# Altium schematic sheet BikerBlinker.SchDoc
size A
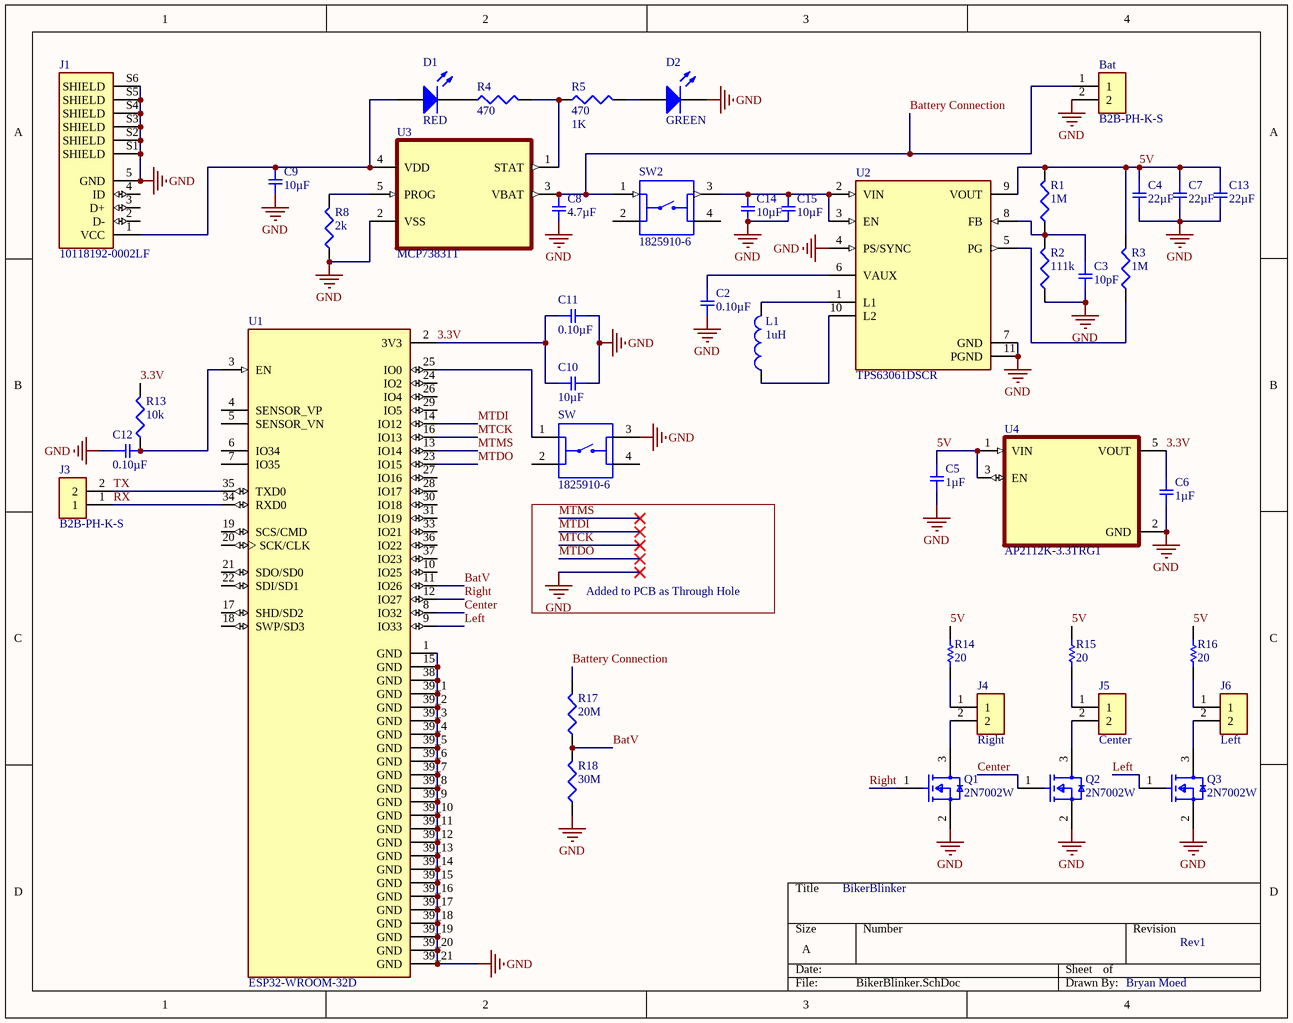
[diagram p0: BikerBlinker.SchDoc]

## Parts
Bat  B2B-PH-K-S  [JST_B2B-PH-K-S(LF)(SN)]
C2  0.10µF  [SMD-0603C]
C3  10pF  [SMD-0603C]
C4  22µF  [SMD-0603C]
C5  1µF  [SMD-0603C]
C6  1µF  [SMD-0603C]
C7  22µF  [SMD-0603C]
C8  4.7µF  [SMD-0603C]
C9  10µF  [SMD-0603C]
C10  10µF  [SMD-0603C]
C11  0.10µF  [SMD-0603C]
C12  0.10µF  [SMD-0603C]
C13  22µF  [SMD-0603C]
C14  10µF  [SMD-0603C]
C15  10µF  [SMD-0603C]
D1  RED  [J1-0603]
D2  GREEN  [J1-0603]
J1  10118192-0002LF  [AMPHENOL_10118192-0002LF]
J3  B2B-PH-K-S  [JST_B2B-PH-K-S(LF)(SN)]
J4  Right  [JST_B2B-PH-K-S(LF)(SN)]
J5  Center  [JST_B2B-PH-K-S(LF)(SN)]
J6  Left  [JST_B2B-PH-K-S(LF)(SN)]
L1  1uH  [0603]
Q1  2N7002W  [FP-419AB-01-IPC_C]
Q2  2N7002W  [FP-419AB-01-IPC_C]
Q3  2N7002W  [FP-419AB-01-IPC_C]
R1  1M  [J1-0603]
R2  111k  [J1-0603]
R3  1M  [J1-0603]
R4  470  [J1-0603]
R5  470  value 1K  [J1-0603]
R8  2k  [J1-0603]
R13  10k  [J1-0603]
R14  20  [AXIAL-0.3]
R15  20  [AXIAL-0.3]
R16  20  [AXIAL-0.3]
R17  20M  [J1-0603]
R18  30M  [J1-0603]
SW  1825910-6  [SW_1825910-6-4]
SW2  1825910-6  [SW_1825910-6-4]
U1  ESP32-WROOM-32D  [MODULE_ESP32-WROOM-32D]
U2  TPS63061DSCR  [CONV_TPS63061DSCR]
U3  MCP73831T  [SOT95P280X145-5N]
U4  AP2112K-3.3TRG1  [SOT95P285X140-5N]

## Nets
GND: Bat.2 C2.2 C3.2 C4.2 C5.2 C6.2 C7.2 C8.2 C9.2 C10.2 C11.2 C12.1 C13.2 C14.2 C15.2 D2.2(K) J1.5(GND) J1.S1(SHIELD) J1.S2(SHIELD) J1.S3(SHIELD) J1.S4(SHIELD) J1.S5(SHIELD) J1.S6(SHIELD) Q1.2(Source) Q2.2(Source) Q3.2(Source) R2.1 R8.1 R18.1 SW.3 U1.1(GND) U1.15(GND) U1.38(GND) U1.39_1(GND) U1.39_2(GND) U1.39_3(GND) U1.39_4(GND) U1.39_5(GND) U1.39_6(GND) U1.39_7(GND) U1.39_8(GND) U1.39_9(GND) U1.39_10(GND) U1.39_11(GND) U1.39_12(GND) U1.39_13(GND) U1.39_14(GND) U1.39_15(GND) U1.39_16(GND) U1.39_17(GND) U1.39_18(GND) U1.39_19(GND) U1.39_20(GND) U1.39_21(GND) U2.4(PS/SYNC) U2.7(GND) U2.11(PGND) U3.2(VSS) U4.2(GND)
3.3V: C6.1 C10.1 C11.1 R13.2 U1.2(3V3) U4.5(VOUT)
5V: C4.1 C5.1 C7.1 C13.1 R1.2 R3.2 R14.2 R15.2 R16.2 U2.9(VOUT) U4.1(VIN) U4.3(EN)
Battery Connection: Bat.1 C8.1 R17.2 SW2.1 U3.3(VBAT)
BatV: R17.1 R18.2 U1.11(IO26)
Center: Q2.1(Gate) U1.8(IO32)
Left: Q3.1(Gate) U1.9(IO33)
MTCK: U1.16(IO13)
MTDI: U1.14(IO12)
MTDO: U1.23(IO15)
MTMS: U1.13(IO14)
Right: Q1.1(Gate) U1.12(IO27)
RX: J3.1 U1.34(RXD0)
TX: J3.2 U1.35(TXD0)
NetC2_1: C2.1 U2.6(VAUX)
NetC3_1: C3.1 R1.1 R2.2 U2.8(FB)
NetC9_1: C9.1 D1.1(A) J1.1(VCC) U3.4(VDD)
NetC12_2: C12.2 R13.1 U1.3(EN)
NetC14_1: C14.1 C15.1 SW2.3 U2.2(VIN) U2.3(EN)
NetD1_2: D1.2(K) R4.1
NetD2_1: D2.1(A) R5.2
NetJ4_1: J4.1 R14.1
NetJ4_2: J4.2 Q1.3(Drain)
NetJ5_1: J5.1 R15.1
NetJ5_2: J5.2 Q2.3(Drain)
NetJ6_1: J6.1 R16.1
NetJ6_2: J6.2 Q3.3(Drain)
NetL1_1: L1.1 U2.10(L2)
NetL1_2: L1.2 U2.1(L1)
NetR3_1: R3.1 U2.5(PG)
NetR4_2: R4.2 R5.1 U3.1(STAT)
NetR8_2: R8.2 U3.5(PROG)
NetSW_1: SW.1 U1.25(IO0)

Not connected (* = marked no-connect by the designer): J1 2(D-) 3(D+) 4(ID); SW 2 4; SW2 2 4; U1 4(SENSOR_VP) 5(SENSOR_VN) 6(IO34) 7(IO35) 10(IO25) 17(SHD/SD2) 18(SWP/SD3) 19(SCS/CMD) 20(SCK/CLK) 21(SDO/SD0) 22(SDI/SD1) 24(IO2) 26(IO4) 27(IO16) 28(IO17) 29(IO5) 30(IO18) 31(IO19) 33(IO21) 36(IO22) 37(IO23); U4 4(NC)

## Notes on the sheet
- Added to PCB as Through Hole
- BikerBlinker
- Rev1
- Bryan Moed

## Library data of the parts
Bat J3-J6 = B2B-PH-K-S(LF)(SN): Connector Header Through Hole 2 position 0.079 _2.00mm_; MF: JST Sales; MP: B2B-PH-K-S_LF__SN_; Package: None; Value: *; Price: None; Availability: Unavailable; SnapEDA_Link: https://www.snapeda.com/parts/B2B-PH-K-S%28LF%29%28SN%29/JST%20Sales%20America%20Inc./view-part/424103/?ref=snap
C2 C11 C12 = GCJ188R71C104KA01D: CAP CER 0.1UF 16V X7R 0603; Manufacturer: Murata Electronics North America; Factory Stock: 0; Unit Price (USD): 0.21; Minimum Quantity: 1; Tolerance: ±10%; Datasheets: http://www.murata.com/~/media/webrenewal/support/library/catalog/products/capacitor/mlcc/c03e.ashx; Image: //media.digikey.com/Renders/Murata%20Renders/0603%28LQG18%29.jpg; Digi-Key Part Number: 490-5796-1-ND; Part Number: GCJ188R71C104KA01D; Quantity Available: 22473; @ qty: 0; Packaging: Cut Tape (CT); Series: GCJ; Part Status: Active; Value: 0.10µF; Voltage: 16V; Temperature Coefficient: X7R; Operating Temperature: -55°C ~ 125°C; Features: Soft Termination; Ratings: AEC-Q200; Applications: Automotive, Boardflex Sensitive; Mounting Type: Surface Mount, MLCC; Package / Case: 0603 (1608 Metric); Size / Dimension: 0.063" L x 0.031" W (1.60mm x 0.80mm); Height - Seated (Max): -; Thickness (Max): 0.035" (0.90mm); Lead Spacing: -; Lead Style: -
C3 = GCM1885C1H100FA16D: CAP CER 10PF 50V NP0 0603; Manufacturer: Murata Electronics North America; Factory Stock: 0; Unit Price (USD): 0.11; Minimum Quantity: 1; Tolerance: ±1%; Temperature Coefficient: C0G, NP0; Datasheets: http://psearch.en.murata.com/capacitor/product/GCM1885C1H100FA16%23.pdf; Image: //media.digikey.com/Renders/Murata%20Renders/0603%28GCM188%29.jpg; Digi-Key Part Number: 490-12530-1-ND; Part Number: GCM1885C1H100FA16D; Quantity Available: 652; @ qty: 0; Packaging: Cut Tape (CT); Series: GCM; Part Status: Active; Value: 10pF; Voltage: 50V; Operating Temperature: -55°C ~ 125°C; Features: -; Ratings: AEC-Q200; Applications: Automotive; Mounting Type: Surface Mount, MLCC; Package / Case: 0603 (1608 Metric); Size / Dimension: 0.063" L x 0.031" W (1.60mm x 0.80mm); Height - Seated (Max): -; Thickness (Max): 0.035" (0.90mm); Lead Spacing: -; Lead Style: -
C4 C7 C13 = GRM186R60J226ME15D: CAP CER 22UF 6.3V X5R 0603; Manufacturer: Murata Electronics North America; Factory Stock: 0; Unit Price (USD): 0.32; Minimum Quantity: 1; Tolerance: ±20%; Datasheets: http://psearch.en.murata.com/capacitor/product/GRM186R60J226ME15%23.pdf; Image: //media.digikey.com/Renders/Murata%20Renders/ZRB-SERIES-0402.jpg; Digi-Key Part Number: 490-13241-1-ND; Part Number: GRM186R60J226ME15D; Quantity Available: 5072; @ qty: 0; Packaging: Cut Tape (CT); Series: GRM; Part Status: Active; Value: 22µF; Voltage: 6.3V; Temperature Coefficient: X5R; Operating Temperature: -55°C ~ 85°C; Features: Derating Recommended; Ratings: -; Applications: General Purpose; Mounting Type: Surface Mount, MLCC; Package / Case: 0603 (1608 Metric); Size / Dimension: 0.063" L x 0.031" W (1.60mm x 0.80mm); Height - Seated (Max): -; Thickness (Max): 0.028" (0.70mm); Lead Spacing: -; Lead Style: -
C5 C6 = GCM188R71C105KA64D: CAP CER 1UF 16V X7R 0603; Manufacturer: Murata Electronics North America; Factory Stock: 0; Unit Price (USD): 0.24; Minimum Quantity: 1; Tolerance: ±10%; Datasheets: http://www.murata.com/~/media/webrenewal/support/library/catalog/products/capacitor/mlcc/c03e.ashx; Image: //media.digikey.com/Renders/Murata%20Renders/0603%28GCM188%29.jpg; Digi-Key Part Number: 490-5241-1-ND; Part Number: GCM188R71C105KA64D; Quantity Available: 9243; @ qty: 0; Packaging: Cut Tape (CT); Series: GCM; Part Status: Active; Value: 1µF; Voltage: 16V; Temperature Coefficient: X7R; Operating Temperature: -55°C ~ 125°C; Features: -; Ratings: AEC-Q200; Applications: Automotive; Mounting Type: Surface Mount, MLCC; Package / Case: 0603 (1608 Metric); Size / Dimension: 0.063" L x 0.031" W (1.60mm x 0.80mm); Height - Seated (Max): -; Thickness (Max): 0.035" (0.90mm); Lead Spacing: -; Lead Style: -
C8 = GRJ188C70J475KE11D: CAP CER 4.7UF 6.3V X7S 0603; Manufacturer: Murata Electronics North America; Factory Stock: 0; Unit Price (USD): 0.34; Minimum Quantity: 1; Tolerance: ±10%; Datasheets: http://www.murata.com/~/media/webrenewal/support/library/catalog/products/capacitor/mlcc/c02e.pdf; Image: //media.digikey.com/Renders/Murata%20Renders/0603%28LQG18%29.jpg; Digi-Key Part Number: 490-10884-1-ND; Part Number: GRJ188C70J475KE11D; Quantity Available: 9234; @ qty: 0; Packaging: Cut Tape (CT); Series: GRJ; Part Status: Active; Value: 4.7µF; Voltage: 6.3V; Temperature Coefficient: X7S; Operating Temperature: -55°C ~ 125°C; Features: Soft Termination; Ratings: -; Applications: Boardflex Sensitive; Mounting Type: Surface Mount, MLCC; Package / Case: 0603 (1608 Metric); Size / Dimension: 0.063" L x 0.031" W (1.60mm x 0.80mm); Height - Seated (Max): -; Thickness (Max): 0.039" (1.00mm); Lead Spacing: -; Lead Style: -
C9 C10 C14 C15 = GRM185R60J106ME15D: CAP CER 10UF 6.3V X5R 0603; Manufacturer: Murata Electronics North America; Factory Stock: 0; Unit Price (USD): 0.36; Minimum Quantity: 1; Tolerance: ±20%; Datasheets: http://www.murata.com/~/media/webrenewal/support/library/catalog/products/capacitor/mlcc/c02e.pdf; Image: //media.digikey.com/Renders/Murata%20Renders/ZRB-SERIES-0402.jpg; Digi-Key Part Number: 490-10467-1-ND; Part Number: GRM185R60J106ME15D; Quantity Available: 25068; @ qty: 0; Packaging: Cut Tape (CT); Series: GRM; Part Status: Active; Value: 10µF; Voltage: 6.3V; Temperature Coefficient: X5R; Operating Temperature: -55°C ~ 85°C; Features: Derating Recommended; Ratings: -; Applications: General Purpose; Mounting Type: Surface Mount, MLCC; Package / Case: 0603 (1608 Metric); Size / Dimension: 0.063" L x 0.031" W (1.60mm x 0.80mm); Height - Seated (Max): -; Thickness (Max): 0.022" (0.55mm); Lead Spacing: -; Lead Style: -
D1 D2 = LED1: Typical RED GaAs LED; Published: 8-Jun-2000; LatestRevisionDate: 08-Jul-2005; LatestRevisionNote: Mech Layer 1 removed.; PackageReference: LED-1; Publisher: Altium Limited; PackageDescription: LED; 2 Leads
J1 = 10118192-0002LF: USB - micro B USB 2.0 Receptacle Connector 5 Position Surface Mount, Right Angle; MF: Amphenol ICC; MP: 10118192-0002LF; SnapEDA_Link: https://www.snapeda.com/parts/10118192-0002LF/Amphenol%20FCI/view-part/551616/?ref=snap; Price: None; Mouser-Purchase-URL: https://snapeda.com/shop?store=Mouser&id=551616; Availability: Good; DigiKey-Purchase-URL: https://snapeda.com/shop?store=DigiKey&id=551616; Package: None; Value: *; Arrow_Electronics-Purchase-URL: https://snapeda.com/shop?store=Arrow+Electronics&id=551616
L1 = Inductor: Code_IEC: 1005; Published: 8-Jun-2000; LatestRevisionDate: 29-May-2009; LatestRevisionNote: IPC-7351 Footprint Added.; PackageReference: 0402-A; Publisher: Altium Limited; PackageDescription: Chip Inductor; Code_JEITA: 0402
Q1-Q3 = CMP-07173-000098-1: MOSFET N-CH 60V 115MA SOT-323; Turn-On Delay Time: 5.85ns; Number of Elements: 1; Max Power Dissipation: 200mW; On-State Resistance: 7.5R; Element Configuration: Single; Gate to Source Voltage (Vgs): 20V; Input Capacitance: 50pF; Threshold Voltage: 1.76V; Turn-Off Delay Time: 12.5ns; Height: 1mm; Contact Plating: Tin; Package Quantity: 1; Continuous Drain Current (ID): 115mA; Case/Package: SOT-323; Lead Free: Lead Free; REACH SVHC: No SVHC; Packaging: Tape and Reel; Min Operating Temperature: -55°C; Weight: 0.03g; Drain to Source Voltage (Vdss): 60V; Width: 1.25mm; Mount: Surface Mount; Rds On Max: 7.5R; Drain to Source Resistance: 7.5R; Max Operating Temperature: 150°C; Radiation Hardening: No; Number of Pins: 3; Power Dissipation: 200mW; Drain to Source Breakdown Voltage: 60V; Length: 2mm
R1-R5 R8 R13 R17 R18 = Res3: Resistor; Published: 8-Jun-2000; LatestRevisionDate: 29-May-2009; LatestRevisionNote: IPC-7351 Footprint Added.; PackageReference: J1-0603; Publisher: Altium Limited; PackageDescription: Chip Resistor
R14-R16 = Res1: Resistor; Published: 8-Jun-2000; LatestRevisionDate: 17-Jul-2002; LatestRevisionNote: Re-released for DXP Platform.; PackageReference: AXIAL-0.3; Publisher: Altium Limited; PackageDescription: Axial Device, Thru-Hole; 2 Leads; 0.3 in Pin Spacing
SW SW2 = 1825910-6: Switch Push Button OFF _ON_ SPST Round Button 0.05A 24VDC Momentary Contact PC Pins Thru-Hole; Configuration_Pole-Throw: Single Pole - Single Throw; MF: TE Connectivity; Contact_Current_Rating: 50 mA; Digi-Key_Purchase_URL: https://www.digikey.com/product-detail/en/te-connectivity-alcoswitch-switches/1825910-6/450-1650-ND/1632536?utm_source=snapeda&utm_medium=aggregator&utm_campaign=symbol; TE_purchase_URL: https://www.te.com/usa-en/product-1825910-6.html?te_bu=Cor&te_type=disp&te_campaign=seda_glo_cor-seda-global-disp-prtnr-fy19-seda-model-bom-cta_sma-317_1&elqCampaignId=32493; Value: *; Digi-Key_Part_Number: 450-1650-ND; SnapEDA_Link: https://www.snapeda.com/parts/1825910-6/TE%20Connectivity%20ALCOSWITCH%20Switches/view-part/424522/?ref=snap; EU_RoHS_Compliance: Compliant; MP: 1825910-6; Package: None
U1 = ESP32-WROOM-32D: Bluetooth, WiFi 802.11b/g/n, Bluetooth v4.2 + EDR, Class 1, 2 and 3 Transceiver Module 2.4GHz ~ 2.5GHz Integrated, Trace Surface Mount; MF: Espressif Systems; Price: None; Package: Module Espressif Systems; Availability: Unavailable; SnapEDA_Link: https://www.snapeda.com/parts/ESP32-WROOM-32D/Espressif%20Systems/view-part/2768115/?ref=snap; Value: *; MP: ESP32-WROOM-32D
U3 = MCP73831T-4ADI/OT: Charger IC Lithium Ion/Polymer SOT-23-5; MF: Microchip; MP: MCP73831T-4ADI/OT; Value: *; SnapEDA_Link: https://www.snapeda.com/parts/MCP73831T-4ADI/OT/Microchip/view-part/1037576/?ref=snap; Package: SOT-23-5 Microchip; Availability: Unavailable; Price: None
U4 = AP2112K-1.8TRG1: Linear Voltage Regulator IC 1 Output 600mA SOT-25; MF: Diodes Inc.; Price: None; Purchase-URL: https://pricing.snapeda.com/search/part/AP2112K-1.8TRG1/?ref=eda; Value: *; Package: SOT-753 Diodes Inc.; SnapEDA_Link: https://www.snapeda.com/parts/AP2112K-1.8TRG1/Diodes%20Inc./view-part/553400/?ref=snap; Availability: Good; MP: AP2112K-3.3TRG1
U2 = TPS63061DSCR: Package: None; Value: *; MP: TPS63061DSCR; Availability: Unavailable; Price: None